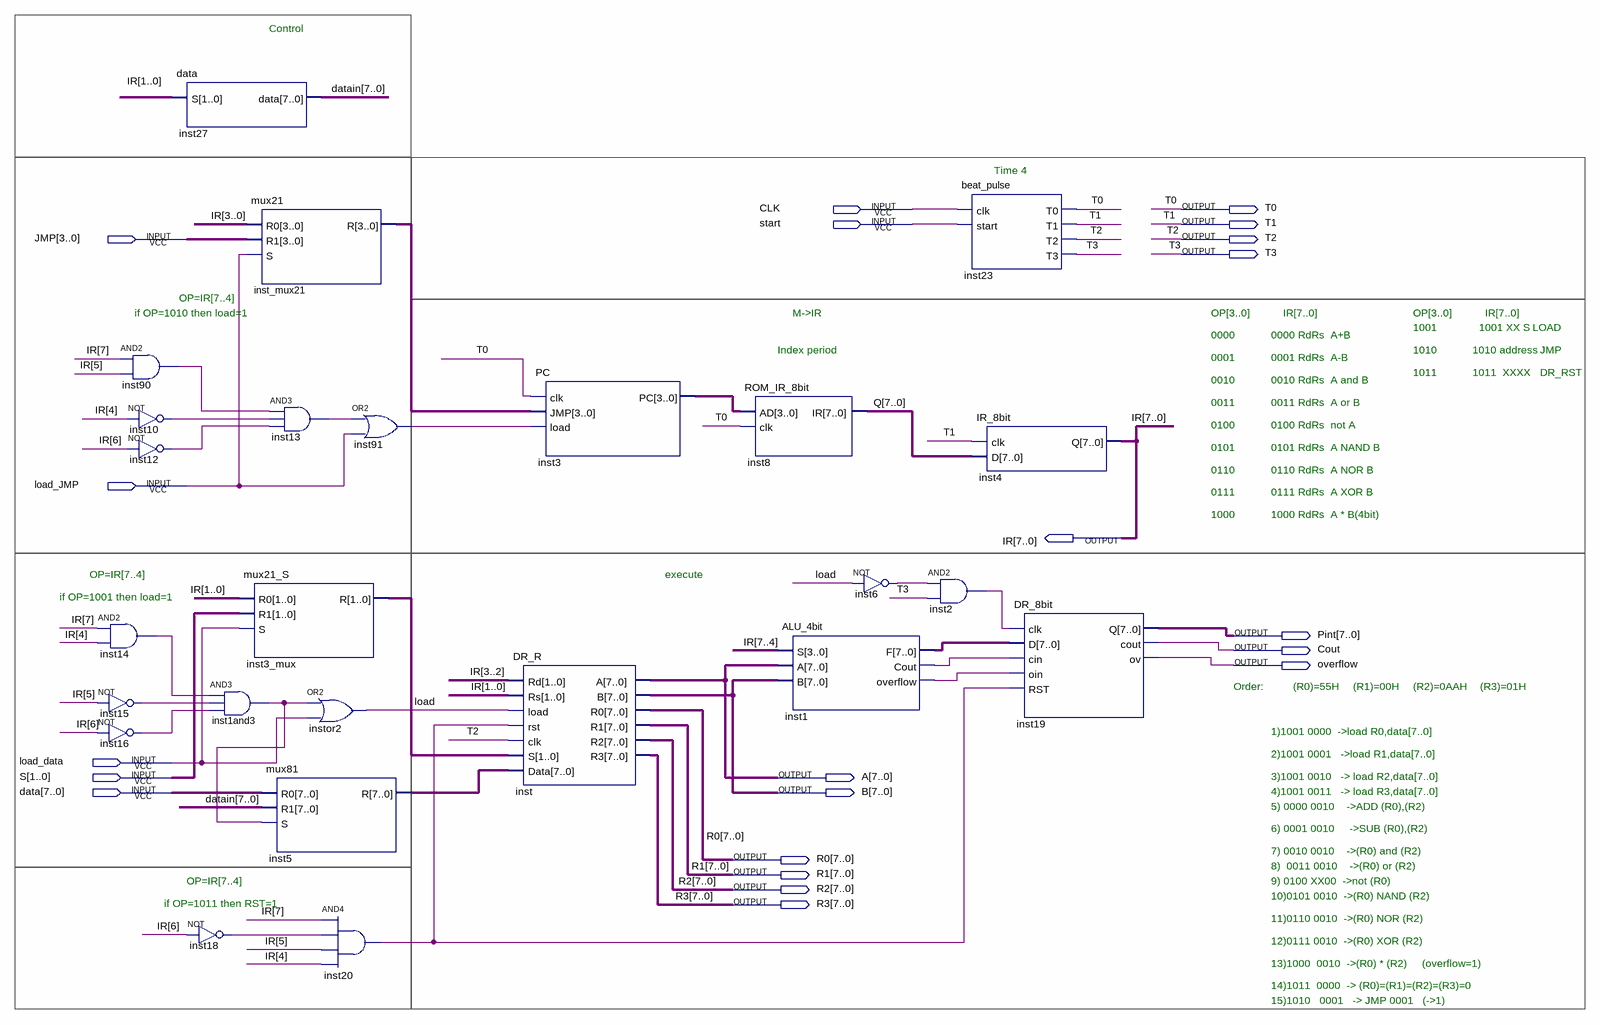
[diagram p0: schematic sheet]
// Quartus schematic CPU.bdf as structural Verilog: 25 symbols, 21 pins
module CPU (
  input  CLK,
  input  start,
  input  [3:0] JMP,
  input  load_JMP,
  input  load_data,
  input  [1:0] S,
  input  [7:0] data,
  output T0,
  output T1,
  output T2,
  output T3,
  output [7:0] IR,
  output [7:0] Pint,
  output Cout,
  output overflow,
  output [7:0] A,
  output [7:0] B,
  output [7:0] R0,
  output [7:0] R1,
  output [7:0] R2,
  output [7:0] R3
);

  wire inst1_cout, inst1_overflow, inst1and3_out, inst2_out, inst6_out, inst10_out, inst12_out, inst13_out,
       inst14_out, inst15_out, inst16_out, inst18_out, inst20_out, inst90_out, inst91_out, load;
  wire [1:0] inst3_mux_r;
  wire [3:0] inst3_pc, inst_mux21_r;
  wire [7:0] datain, inst1_f, inst5_r, Q;

  and inst14 (inst14_out, IR[7], IR[4]);
  not inst15 (inst15_out, IR[5]);
  not inst16 (inst16_out, IR[6]);
  and inst90 (inst90_out, IR[7], IR[5]);
  not inst10 (inst10_out, IR[4]);
  not inst12 (inst12_out, IR[6]);
  data inst27 (.S(IR[1:0]), .data(datain));
  and inst1and3 (inst1and3_out, inst14_out, inst15_out, inst16_out);
  not inst18 (inst18_out, IR[6]);
  mux21 inst_mux21 (.R0(IR[3:0]), .R1(JMP), .S(load_JMP), .R(inst_mux21_r));
  and inst13 (inst13_out, inst90_out, inst10_out, inst12_out);
  mux21_S inst3_mux (.R0(IR[1:0]), .R1(S), .S(load_data), .R(inst3_mux_r));
  mux81 inst5 (.R0(data), .R1(datain), .S(inst1and3_out), .R(inst5_r));
  or instor2 (load, inst1and3_out, load_data);
  and inst20 (inst20_out, IR[7], inst18_out, IR[5], IR[4]);
  or inst91 (inst91_out, inst13_out, load_JMP);
  DR_R inst (
    .Rd(IR[3:2]), .Rs(IR[1:0]), .load(load), .rst(inst20_out), .clk(T2), .S(inst3_mux_r), .Data(inst5_r),
    .A(A), .B(B), .R0(R0), .R1(R1), .R2(R2), .R3(R3));
  PC inst3 (.clk(T0), .JMP(inst_mux21_r), .load(inst91_out), .PC(inst3_pc));
  ROM_IR_8bit inst8 (.AD(inst3_pc), .clk(T0), .IR(Q));
  ALU_4bit inst1 (.S(IR[7:4]), .A(A), .B(B), .F(inst1_f), .Cout(inst1_cout), .overflow(inst1_overflow));
  not inst6 (inst6_out, load);
  and inst2 (inst2_out, inst6_out, T3);
  beat_pulse inst23 (.clk(CLK), .start(start), .T0(T0), .T1(T1), .T2(T2), .T3(T3));
  IR_8bit inst4 (.clk(T1), .D(Q), .Q(IR));
  DR_8bit inst19 (
    .clk(inst2_out), .D(inst1_f), .cin(inst1_cout), .oin(inst1_overflow), .RST(inst20_out), .Q(Pint),
    .cout(Cout), .ov(overflow));

  // Notes on the sheet:
  //   Control
  //   Time 4
  //   OP=IR[7..4]
  //   if OP=1010 then load=1
  //   M->IR
  //   OP[3..0]           IR[7..0]
  //   OP[3..0]           IR[7..0]
  //   1001              1001 XX S
  //   LOAD
  //   0000
  //   0000 RdRs
  //   A+B
  //   Index period
  //   1010
  //   1010 address
  //   JMP
  //   0001
  //   0001 RdRs
  //   A-B
  //   1011
  //   1011
  //   XXXX
  //   DR_RST
  //   0010
  //   0010 RdRs
  //   A and B
  //   0011
  //   0011 RdRs
  //   A or B
  //   0100
  //   0100 RdRs
  //   not A
  //   0101
  //   0101 RdRs
  //   A NAND B
  //   0110
  //   0110 RdRs
  //   A NOR B
  //   0111
  //   0111 RdRs
  //   A XOR B
  //   1000
  //   1000 RdRs
  //   A * B(4bit)
  //   OP=IR[7..4]
  //   execute
  //   if OP=1001 then load=1
  //   Order:
  //   (R0)=55H
  //   (R1)=00H
  //   (R2)=0AAH
  //   (R3)=01H
  //   1)1001 0000  ->load R0,data[7..0]
  //   2)1001 0001   ->load R1,data[7..0]
  //   3)1001 0010   -> load R2,data[7..0]
  //   4)1001 0011   -> load R3,data[7..0]
  //   5) 0000 0010    ->ADD (R0),(R2)
  //   6) 0001 0010     ->SUB (R0),(R2)
  //   7) 0010 0010    ->(R0) and (R2)
  //   8)  0011 0010    ->(R0) or (R2)
  //   OP=IR[7..4]
  //   9) 0100 XX00  ->not (R0)
  //   10)0101 0010  ->(R0) NAND (R2)
  //   if OP=1011 then RST=1
  //   11)0110 0010  ->(R0) NOR (R2)
  //   12)0111 0010  ->(R0) XOR (R2)
  //   13)1000  0010  ->(R0) * (R2)     (overflow=1)
  //   14)1011  0000  -> (R0)=(R1)=(R2)=(R3)=0
  //   15)1010   0001   -> JMP 0001   (->1)
endmodule
